# Altium schematic sheet GTM_MCUcontrolledLEDs.SchDoc
size A4
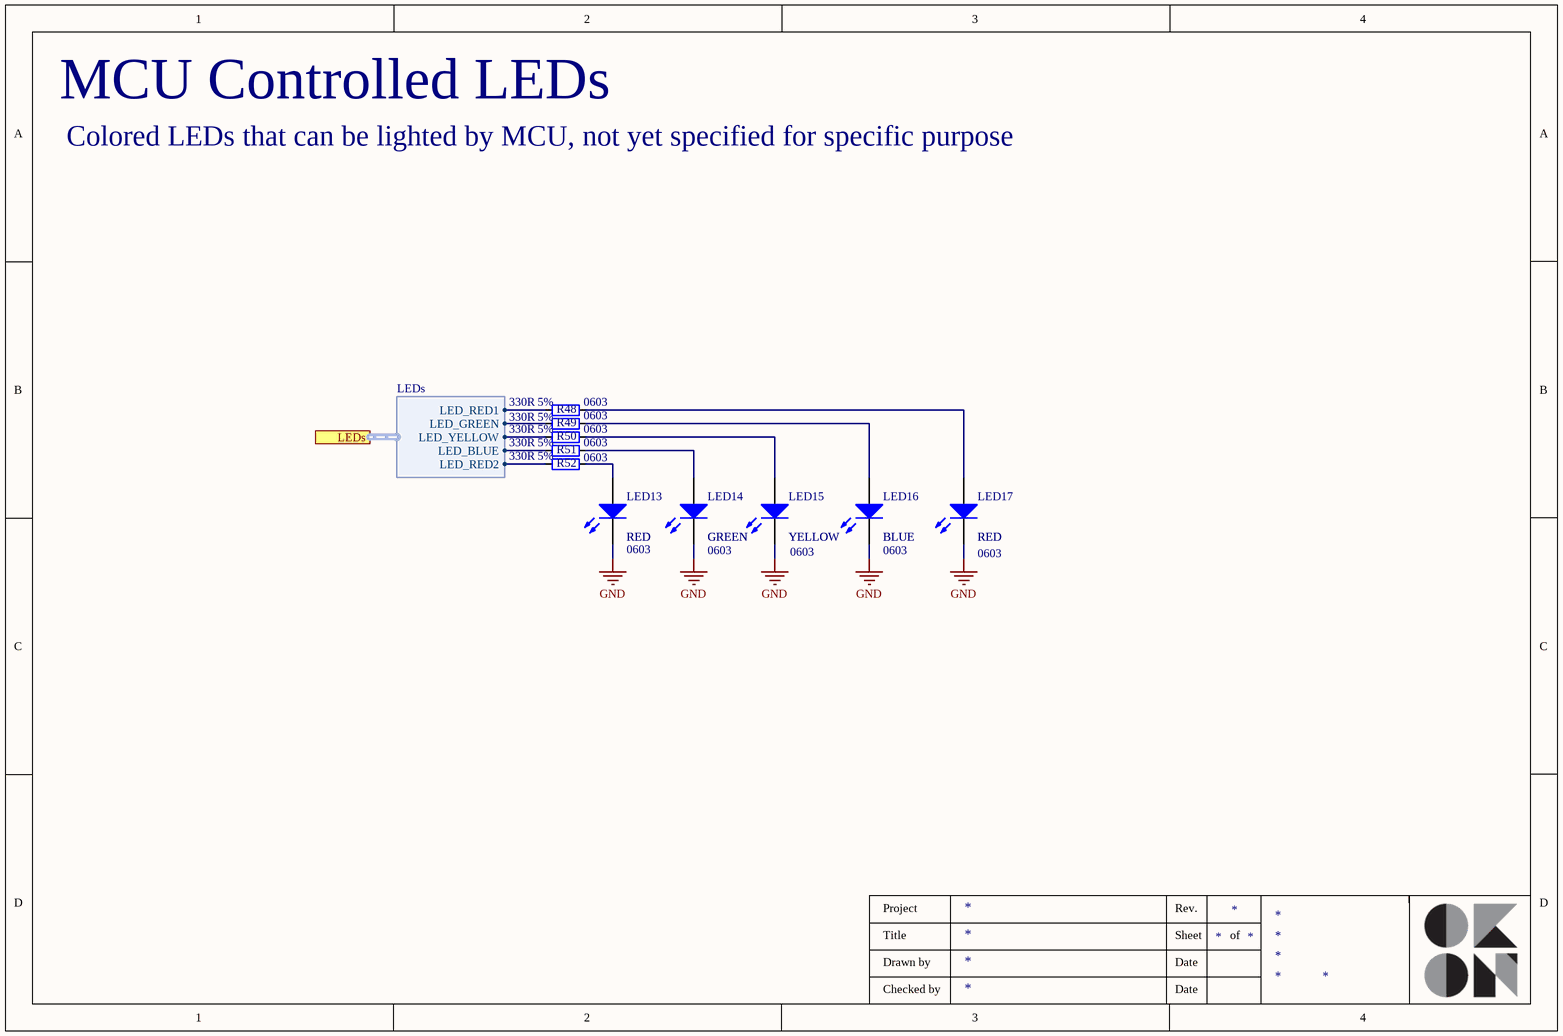
[diagram p0: GTM_MCUcontrolledLEDs.SchDoc]

## Parts
LED13  RED  Package: 0603  [LED_THT_RED]
LED14  GREEN  Package: 0603  [LED_THT_YELLOW]
LED15  YELLOW  Package: 0603  [LED_THT_GREEN]
LED16  BLUE  Package: 0603  [LED_THT_BLUE]
LED17  RED  Package: 0603  [LED_THT_RED]
R48  Tolerance: 5%  [0603]  (hidden comment: 330R)
R49  Tolerance: 5%  [0603]  (hidden comment: 330R)
R50  Tolerance: 5%  [0603]  (hidden comment: 330R)
R51  Tolerance: 5%  [0603]  (hidden comment: 330R)
R52  Tolerance: 5%  [0603]  (hidden comment: 330R)

## Ports
LEDs (harness LEDs)

## Harnesses
LEDs: LED_RED1, LED_GREEN, LED_YELLOW, LED_BLUE, LED_RED2

## Nets
GND: LED13.2(K) LED14.2(K) LED15.2(K) LED16.2(K) LED17.2(K)
NetLED13_1: LED13.1(A) R52.2
NetLED14_1: LED14.1(A) R51.2
NetLED15_1: LED15.1(A) R50.2
NetLED16_1: LED16.1(A) R49.2
NetLED17_1: LED17.1(A) R48.2
NetR48_1: R48.1 ; port LEDs.LED_RED1
NetR49_1: R49.1 ; port LEDs.LED_GREEN
NetR50_1: R50.1 ; port LEDs.LED_YELLOW
NetR51_1: R51.1 ; port LEDs.LED_BLUE
NetR52_1: R52.1 ; port LEDs.LED_RED2

## Notes on the sheet
- MCU Controlled LEDs
- Colored LEDs that can be lighted by MCU, not yet specified for specific purpose
- Project
- Rev.
- Title
- Drawn by
- Date
- Sheet
- of
- Checked by

## Library data of the parts
LED13-LED17 = LED: Light-emitting diode
  LED13 LED17: COLOR: RED
  LED14: COLOR: GREEN
  LED15: COLOR: YELLOW
  LED16: COLOR: BLUE
R48-R52 = RES: Resistior; Value: 330R; Package: 0603